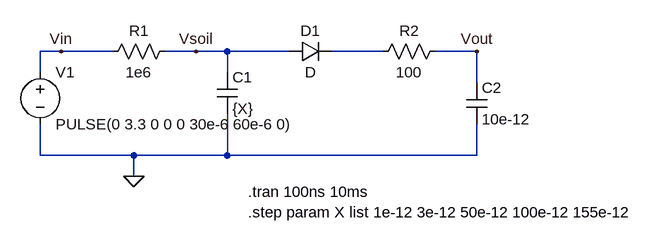
[diagram p0: schematic SoilMoisture.asc]
SoilMoisture.asc, the LTspice schematic file:
Version 4
SHEET 1 1160 680
WIRE 160 208 128 208
WIRE 240 208 160 208
WIRE 368 208 320 208
WIRE 416 208 368 208
WIRE 512 208 416 208
WIRE 656 208 576 208
WIRE 800 208 736 208
WIRE 128 240 128 208
WIRE 416 240 416 208
WIRE 800 256 800 208
WIRE 128 368 128 320
WIRE 272 368 128 368
WIRE 416 368 416 304
WIRE 416 368 272 368
WIRE 800 368 800 320
WIRE 800 368 416 368
WIRE 272 400 272 368
FLAG 272 400 0
FLAG 160 208 Vin
FLAG 368 208 Vsoil
FLAG 800 208 Vout
SYMBOL cap 400 240 R0
SYMATTR InstName C1
SYMATTR Value {X}
SYMBOL voltage 128 224 R0
SYMATTR InstName V1
SYMATTR Value PULSE(0 3.3 0 0 0 30e-6 60e-6 0)
SYMBOL diode 512 224 R270
WINDOW 0 32 32 VTop 2
WINDOW 3 0 32 VBottom 2
SYMATTR InstName D1
SYMBOL res 336 192 R90
WINDOW 0 0 56 VBottom 2
WINDOW 3 32 56 VTop 2
SYMATTR InstName R1
SYMATTR Value 1e6
SYMBOL cap 784 256 R0
SYMATTR InstName C2
SYMATTR Value 10e-12
SYMBOL res 752 192 R90
WINDOW 0 0 56 VBottom 2
WINDOW 3 32 56 VTop 2
SYMATTR InstName R2
SYMATTR Value 100
TEXT 448 424 Left 2 !.tran 100ns 10ms\n.step param X list 1e-12 3e-12 50e-12 100e-12 155e-12

The netlist it stands for:
* SoilMoisture.asc
C1 Vsoil 0 {X}
V1 Vin 0 PULSE(0 3.3 0 0 0 30e-6 60e-6 0)
D1 Vsoil N001 D
R1 Vsoil Vin 1e6
C2 Vout 0 10e-12
R2 Vout N001 100
.model D D
.lib standard.dio
.tran 100ns 10ms
.step param X list 1e-12 3e-12 50e-12 100e-12 155e-12
.backanno
.end